# EAGLE design lcdadapter (EAGLE 6.4)
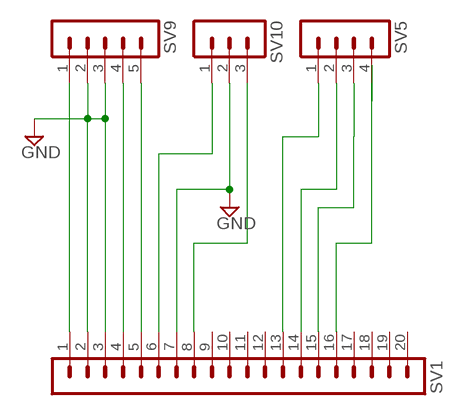
[diagram p0: schematic, sheet 1]

## Parts
SV1  MA20-1L  [MA20-1L]
SV5  MA04-1  [MA04-1]
SV9  MA05-1  [MA05-1]
SV10  MA03-1  [MA03-1]

## Nets
D4: SV1.13 SV5.1
D5: SV1.14 SV5.2
D6: SV1.15 SV5.3
EN: SV1.8 SV10.3
N$1: SV1.16 SV5.4
N$5: SV1.4 SV9.4
N$53: SV1.1 SV9.1
N$120: SV1.2 SV1.3 SV1.7 SV9.2 SV9.3 SV10.2 ; supply symbol labelled GND
N$127: SV1.5 SV9.5
RS: SV1.6 SV10.1
Unconnected: SV1.9 SV1.10 SV1.11 SV1.12 SV1.17 SV1.18 SV1.19 SV1.20

## Library data of the parts
SV1 = con-lstb:MA20-1L: PIN HEADER; OC_FARNELL: unknown; OC_NEWARK: unknown
SV5 = con-lstb:MA04-1: PIN HEADER; OC_FARNELL: unknown; OC_NEWARK: unknown
SV9 = con-lstb:MA05-1: PIN HEADER; OC_FARNELL: unknown; OC_NEWARK: unknown
SV10 = con-lstb:MA03-1: PIN HEADER; OC_FARNELL: unknown; OC_NEWARK: unknown

## Board
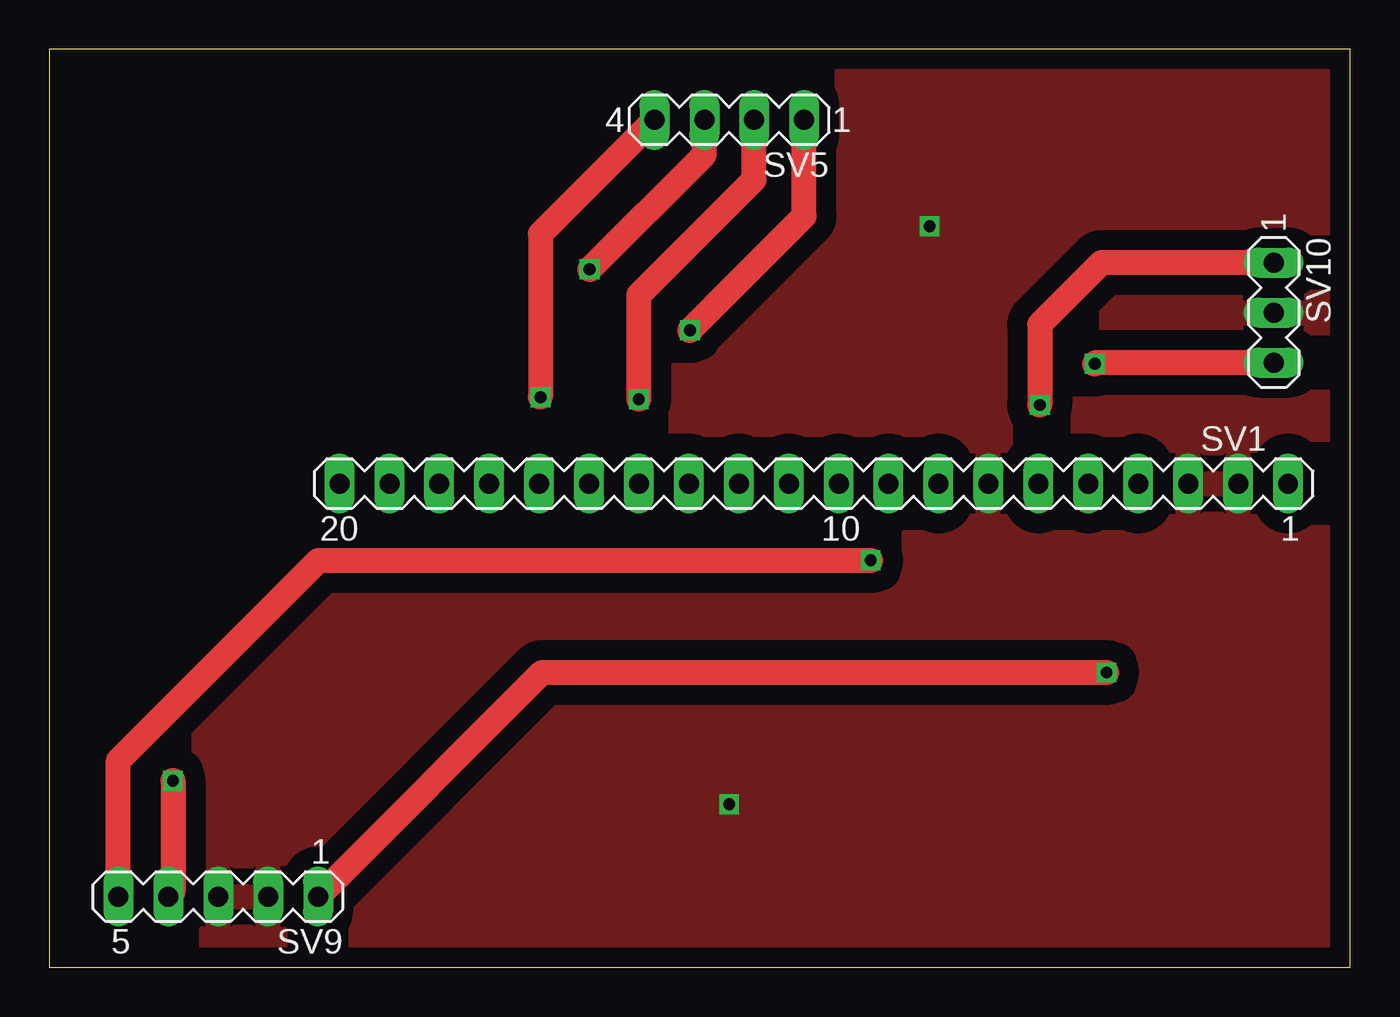
[diagram p1: board, top side]
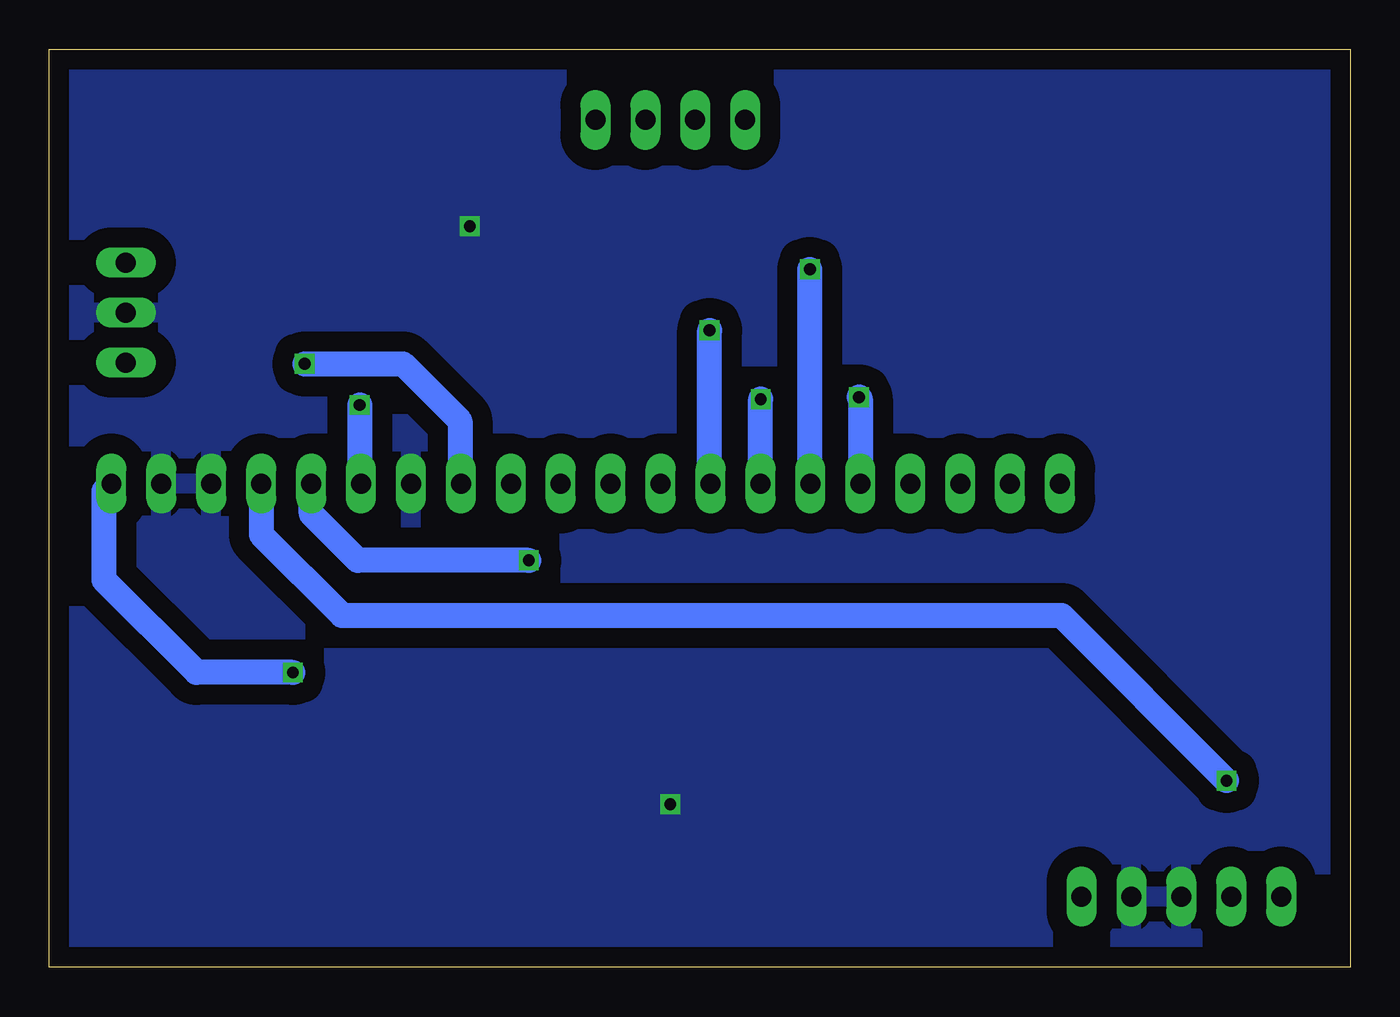
[diagram p2: board, bottom side, seen from below]

Size 66.2 x 46.7 mm. Coordinates in mm from the lower left corner, seen from the top.
Outline: 0,0 66.2,0 66.2,46.7 0,46.7 0,0
Copper layers (1*16): Top 0.035mm / dielectric 1.5mm / Bottom 0.035mm
Design rules "default *": minimum track width 10mil, minimum drill 24mil, track to track 40mil, track to pad 40mil, pad to pad 40mil, via to via 40mil, smd to smd 40mil, copper to edge 40mil, drill to drill 8mil, minimum pad ring 10mil, minimum via ring 8mil, stop-mask expansion 4mil, vias tented up to drill 0mil, thermal gap 10mil

### Footprints (pad centres in the part's own frame; a part is rotated, then mirrored left to right if it is on the bottom)
MA20-1L = drill 1.016 long: 1 24.13,0; 2 21.59,0; 3 19.05,0; 4 16.51,0; 5 13.97,0; 6 11.43,0; 7 8.89,0; 8 6.35,0; 9 3.81,0; 10 1.27,0; 11 -1.27,0; 12 -3.81,0; 13 -6.35,0; 14 -8.89,0; 15 -11.43,0; 16 -13.97,0; 17 -16.51,0; 18 -19.05,0; 19 -21.59,0; 20 -24.13,0
MA04-1 = drill 1.016 long: 1 -3.81,0; 2 -1.27,0; 3 1.27,0; 4 3.81,0
MA05-1 = drill 1.016 long: 1 -5.08,0; 2 -2.54,0; 3 0,0; 4 2.54,0; 5 5.08,0
MA03-1 = drill 1.016 long: 1 -2.54,0; 2 0,0; 3 2.54,0

### Placement (x,y rotation side)
SV1  38.9,24.6 0 top
SV5  34.6,43.1 180 top
SV9  8.6,3.6 180 top
SV10  62.3,33.3 270 top

### Tracks (layer width: path | path; a pad name or v marks a point on that pad's centre or on a via)
D4  (via drill 0.6)
  Top 1.27: v32.6,32.4 38.41,38.21 SV5.1
  Bottom 1.27: SV1.13 32.6,24.65 v32.6,32.4
D5  (via drill 0.6)
  Top 1.27: v30,28.9 30,34.2 35.87,40.07 SV5.2
  Bottom 1.27: SV1.14 v30,28.9
D6  (via drill 0.6)
  Top 1.27: v27.5,35.5 33.33,41.33 SV5.3
  Bottom 1.27: SV1.15 27.5,24.63 v27.5,35.5
EN  (via drill 0.6)
  Top 1.27: SV10.3 53.26,30.76 v53.2,30.7
  Bottom 1.27: v53.2,30.7 48.2,30.7 45.3,27.8 45.3,24.65 SV1.8
N$1  (via drill 0.6)
  Top 1.27: SV5.4 25,37.31 v25,29
  Bottom 1.27: v25,29 24.93,28.93 SV1.16
N$5  (via drill 0.6)
  Top 1.27: v6.3,9.5 6.3,3.84 SV9.4
  Bottom 1.27: SV1.4 55.41,22.01 51.3,17.9 14.7,17.9 v6.3,9.5
N$53  (via drill 0.6)
  Top 1.27: SV9.1 25.08,15 v53.8,15
  Bottom 1.27: v53.8,15 58.7,15 63.4,19.7 63.4,24.23 SV1.1
N$120  (via drill 0.6)
  other vias: 44.8,37.7 34.6,8.3
  pour Bottom: -0.5,-0.6 -0.5,47.4 66.7,47.5 66.7,-0.6
  pour Top: -1.2,-1.8 67.8,-1.8 67.8,48.3 -1.2,48.3
N$127  (via drill 0.6)
  Top 1.27: SV9.5 3.52,10.52 13.7,20.7 v41.8,20.7
  Bottom 1.27: v41.8,20.7 50.5,20.7 52.87,23.07 SV1.5
RS  (via drill 0.6)
  Top 1.27: SV10.1 53.54,35.84 50.4,32.7 v50.4,28.6
  Bottom 1.27: v50.4,28.6 50.4,24.67 SV1.6